# Altium schematic sheet Line-filter.SchDoc
size A4; SheetNumber: 4; SheetTotal: 6
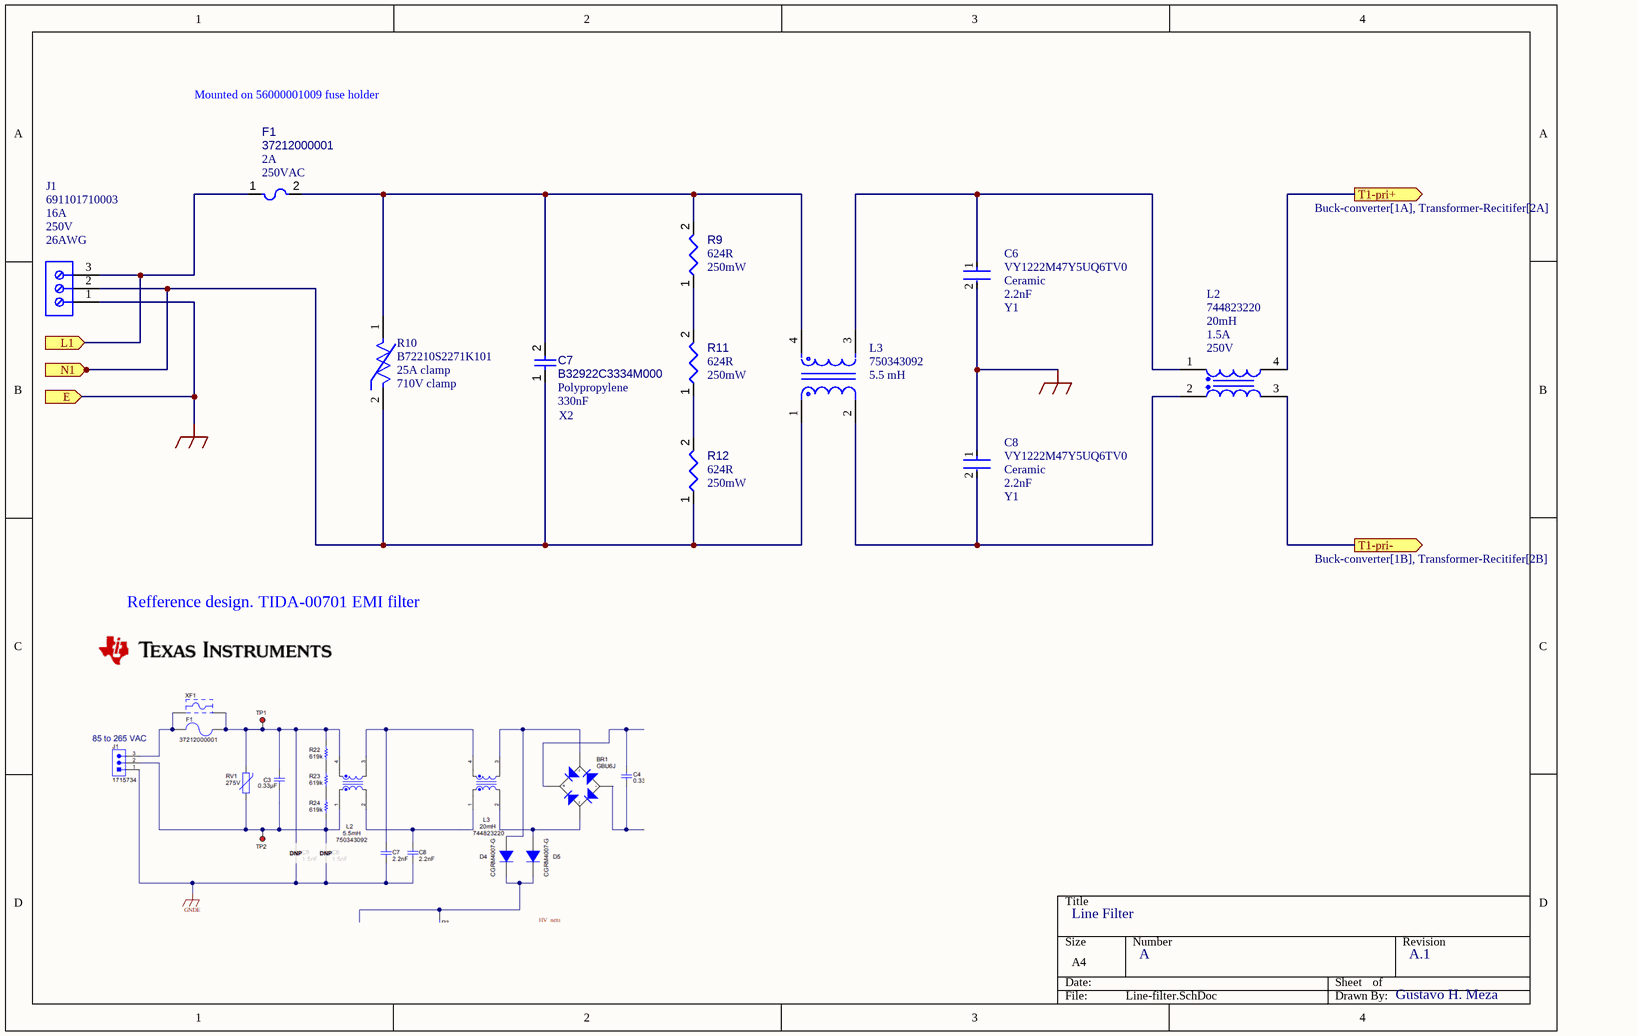
[diagram p0: Line-filter.SchDoc]

## Parts
C6  VY1222M47Y5UQ6TV0  Resistor Type: Ceramic  Capacitance: 2.2nF  Safety rating: Y1  [FP-VY1470-MFG]
C7  B32922C3334M000  value 330nF  Dielectric Material: Polypropylene  Safety rating: X2  [B32922C3334M000-Footprint-1]
C8  VY1222M47Y5UQ6TV0  Resistor Type: Ceramic  Capacitance: 2.2nF  Safety rating: Y1  [FP-VY1470-MFG]
F1  37212000001  Current Rating: 2A  Voltage rating: 250VAC  [37212000001-Footprint-1]
J1  691101710003  Voltage Rating: 250V  Current: 16A  Wire Gauge (Min): 26AWG  [691101710003]
L2  744823220  Voltage Rating: 250V  Current Rating: 1.5A  Inductance: 20mH  [WE-CMB_Type M_L23W13.8H25.5]
L3  750343092  Inductance: 5.5 mH  [FP-750343092-0]
R9  value 624R  Power: 250mW  [RESC3216X06N]  (hidden comment: CRCW1206619KFKEA)
R10  B72210S2271K101  Clamping Current: 25A clamp  Clamping Voltage: 710V clamp  [FP-B72210S2271K101-MFG]
R11  value 624R  Power: 250mW  [RESC3216X06N]  (hidden comment: CRCW1206619KFKEA)
R12  value 624R  Power: 250mW  [RESC3216X06N]  (hidden comment: CRCW1206619KFKEA)

## Ports
E (in), L1 (in), N1 (in), T1-pri+ (out, see Buck-converter[1A], Transformer-Recitifer[2A]), T1-pri- (out, see Buck-converter[1B], Transformer-Recitifer[2B])

## Nets
GND: C6.2 C8.1 J1.1 ; port E
L1: F1.1 J1.3 ; port L1
N1: C7.1 J1.2 L3.1 R10.2 R12.1 ; port N1
T1-pri+: L2.4 ; port T1-pri+
T1-pri-: L2.3 ; port T1-pri-
NetC6_1: C6.1 L2.1 L3.3
NetC7_2: C7.2 F1.2 L3.4 R9.2 R10.1
NetC8_2: C8.2 L2.2 L3.2
NetR9_1: R9.1 R11.2
NetR11_1: R11.1 R12.2

## Notes on the sheet
- Mounted on 56000001009 fuse holder
- Refference design. TIDA-00701 EMI filter
- Line Filter
- A
- A.1
- Gustavo H. Meza

## Library data of the parts
C6 C8 = CMP-02417-000069-1: CAP CER 2200PF 760VAC Y5U RADIAL; Lead Diameter: 0.6mm; Ratings: X1; Voltage Rating (AC): 500V; Lead/Base Style: Kinked; Tolerance: 20%; Max Operating Temperature: 125°C; Contact Plating: Tin; Thickness: 5mm; Width: 5mm; Min Operating Temperature: -40°C; Depth: 5mm; Mount: Through Hole; Termination: Radial; Lead Free: Lead Free; Diameter: 12mm; Height: 15mm; Radiation Hardening: No; Lead Pitch: 10mm; Case/Package: Radial; RoHS Compliant: Yes; Series: VY1; Dielectric: Y5U; Construction: RADIAL; Voltage: 500V; Voltage Rating (DC): 500V; Packaging: Tape and Reel; Height - Seated (Max): 0.63inch; Package Quantity: 500
C7 = CMP-001-00088-1: Film Capacitor, Polypropylene, 630V, 20% +Tol, 20% -Tol, 0.33uF, Through Hole Mount; Max Operating Temperature: 110°C; Min Operating Temperature: -40°C; RoHS Compliant: Yes; Pins: 2; Height: 8mm; Mounting Technology: Through Hole; Capacitor Type: FILM; Case/Package: 7155
F1 = CMP-005-00014-1: Electric Fuse, Time Lag Blow, 2A, 250VAC, 35A (IR), Through Hole, TR5; Body Height: 8mm; Body Length or Diameter: 8.5mm; Min Operating Temperature: -40°C; RoHS Compliant: Yes; Mounting Technology: Through Hole; Circuit Protection Type: Electric Fuse; Max Operating Temperature: 85°C
J1 = CMP-1502-03257-2: NexarPartId: 8917705; Pitch: 5.0038mm; Number of Positions Per Level: 3; Plating: Steel; Number of Levels: 1; Stripping Length: -7mm; REACH SVHC: Unknown; Width: 16.2mm; Height: 16.4mm; Contact Material: Brass; RoHS: Compliant; Color: Blue; Wire Gauge (Max): 26AWG; Contact Plating: Tin; Lead Pitch: 5mm; Packaging: Box; Termination: Screw; Number of Contacts: 3; Wire/Cable Gauge: 26AWG; Min Operating Temperature: -40°C; Max Operating Temperature: 105°C; Housing Material: Nylon; Length: 9mm; Voltage: 250V; Mount: Through Hole; Current Rating: 16A; Number of Pins: 3
L2 = CMP-0223-00090-2: NexarPartId: 22862925; Pin Length: 3mm; Resistance: 270mΩ; Inductance Tolerance: 30%; Max Operating Temperature: 125°C; Length: 23mm; Ambient Temperature Range Low: -40°C; Number of Pins: 4; Ambient Temperature Range High: 70°C; Height: 25.5mm; Min Operating Temperature: -40°C; Width: 13.8mm; RoHS: Compliant; Packaging: Bulk
L3 = CMP-207849-000003-1: Power Common Mode Choke; RoHS Compliant: No
R9 R11 R12 = CMP-009-00188-1: Fixed Resistor, Metal Glaze/thick Film, 0.25W, 619000ohm, 200V, 1% +/-Tol, 100ppm/Cel, Surface Mount, 1206; Additional Feature: RATED AC VOLTAGE (V): 200; JESD-609 Code: e3; Construction: Chip; Min Operating Temperature: -55°C; Mounting Technology: Surface Mount; Max Operating Temperature: 155°C; Tolerance: 1%; Case/Package: 1206; Pins: 2; RoHS Compliant: Yes
R10 = CMP-10618-000003-1: VARISTOR 430V 3.5KA DISC 10MM; Manufacturer: EPCOS; Value: 220pF; Voltage Rating Dc: 350V; Voltage Rating Ac: 275V; Voltage Tolerance: 10%; Temperature Range High: +105°C; RoHS: TRUE; Mouser Description: B722 Series 350 V 275 Vrms 710 V Clamp 3500 A 220 pF AdvanceD Leaded Varistor; ComponentLink2URL: https://www.tdk-electronics.tdk.com/inf/70/db/var/SIOV_Leaded_AdvanceD.pdf; Device Class L3: unset; Octopart: https://octopart.com/b72210s2271k101-epcos-42227876; Varistor Voltage: 430V; Category: Res; Package: 0; Temperature: -40°C to +105°C; ComponentLink2Description: Datasheet; Manufacturer Part Number: B72210S2271K101; Digikey Description: VARISTOR 430V 3.5KA DISC 10MM; Device Class L2: Varistors; Lead Free: Yes; Capacitance: 220pF; Device Class L1: Circuit Protection; Height: 14.5mm; Automotive: No; Temperature Range Low: -40°C